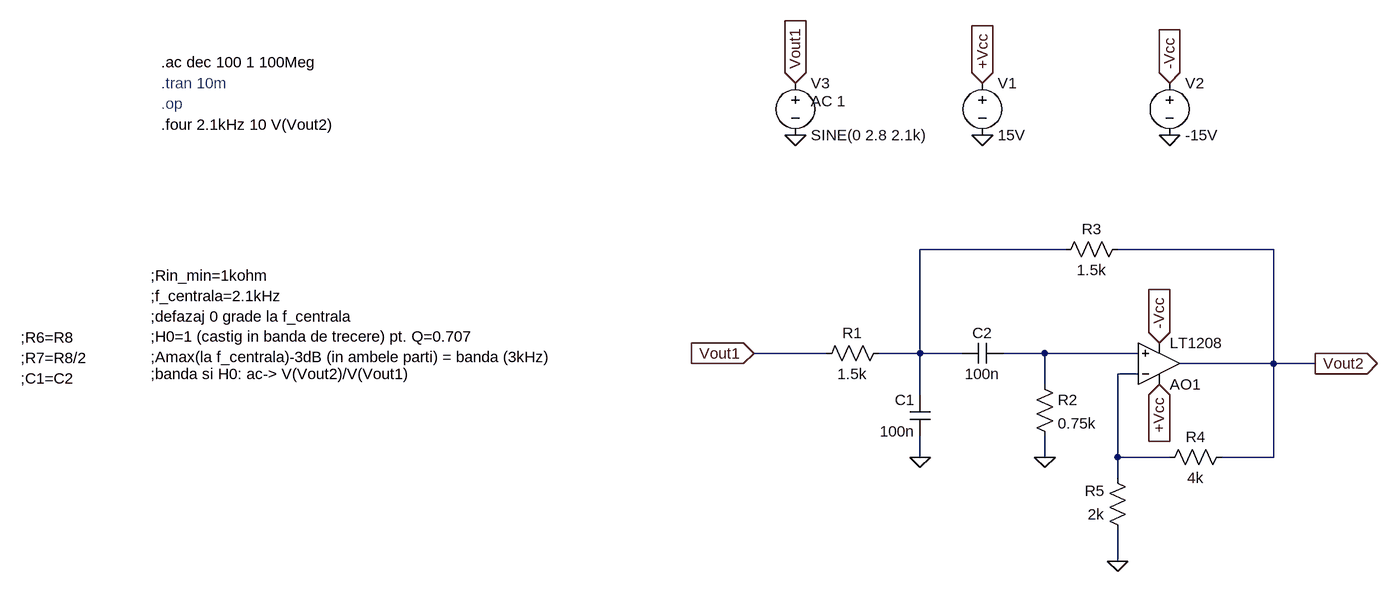
[diagram p0: schematic Filtru.asc]
Filtru.asc, the LTspice schematic file:
Version 4.1
SHEET 1 880 680
WIRE 336 -112 112 -112
WIRE 656 -112 416 -112
WIRE -32 48 -144 48
WIRE 112 48 112 -112
WIRE 112 48 48 48
WIRE 176 48 112 48
WIRE 304 48 240 48
WIRE 448 48 304 48
WIRE 656 64 656 -112
WIRE 656 64 512 64
WIRE 720 64 656 64
WIRE 448 80 416 80
WIRE 304 96 304 48
WIRE 112 112 112 48
WIRE 112 208 112 176
WIRE 304 208 304 176
WIRE 416 208 416 80
WIRE 496 208 416 208
WIRE 656 208 656 64
WIRE 656 208 576 208
WIRE 416 240 416 208
WIRE 416 368 416 320
FLAG -144 48 Vout1
IOPIN -144 48 In
FLAG 112 208 0
FLAG 304 208 0
FLAG 416 368 0
FLAG 720 64 Vout2
IOPIN 720 64 Out
FLAG 480 96 +Vcc
IOPIN 480 96 In
FLAG 480 32 -Vcc
IOPIN 480 32 In
FLAG 208 -368 +Vcc
IOPIN 208 -368 In
FLAG 496 -368 -Vcc
IOPIN 496 -368 In
FLAG 208 -288 0
FLAG 496 -288 0
FLAG -80 -368 Vout1
IOPIN -80 -368 In
FLAG -80 -288 0
SYMBOL res -48 64 R270
WINDOW 0 32 56 VTop 2
WINDOW 3 0 56 VBottom 2
SYMATTR InstName R1
SYMATTR Value 1.5k
SYMBOL cap 128 176 R180
WINDOW 0 24 56 Left 2
WINDOW 3 24 8 Left 2
SYMATTR InstName C1
SYMATTR Value 100n
SYMBOL cap 176 64 R270
WINDOW 0 32 32 VTop 2
WINDOW 3 0 32 VBottom 2
SYMATTR InstName C2
SYMATTR Value 100n
SYMBOL res 288 80 R0
SYMATTR InstName R2
SYMATTR Value 0.75k
SYMBOL OpAmps\\LT1208 480 128 M180
SYMATTR InstName AO1
SYMBOL res 320 -96 R270
WINDOW 0 32 56 VTop 2
WINDOW 3 0 56 VBottom 2
SYMATTR InstName R3
SYMATTR Value 1.5k
SYMBOL res 480 224 R270
WINDOW 0 32 56 VTop 2
WINDOW 3 0 56 VBottom 2
SYMATTR InstName R4
SYMATTR Value 4k
SYMBOL res 432 336 R180
WINDOW 0 36 76 Left 2
WINDOW 3 36 40 Left 2
SYMATTR InstName R5
SYMATTR Value 2k
SYMBOL voltage 208 -384 R0
WINDOW 123 24 44 Left 2
WINDOW 39 0 0 Left 0
SYMATTR InstName V1
SYMATTR Value 15V
SYMBOL voltage 496 -384 R0
SYMATTR InstName V2
SYMATTR Value -15V
SYMBOL voltage -80 -384 R0
WINDOW 123 24 44 Left 2
WINDOW 39 0 0 Left 0
SYMATTR Value2 AC 1
SYMATTR InstName V3
SYMATTR Value SINE(0 2.8 2.1k)
TEXT -1272 24 Left 2 !;R6=R8\n;R7=R8/2\n;C1=C2
TEXT -1072 -72 Left 2 !;Rin_min=1kohm
TEXT -1072 -40 Left 2 !;f_centrala=2.1kHz\n;defazaj 0 grade la f_centrala\n;H0=1 (castig in banda de trecere) pt. Q=0.707\n;Amax(la f_centrala)-3dB (in ambele parti) = banda (3kHz)
TEXT -1072 80 Left 2 !;banda si H0: ac-> V(Vout2)/V(Vout1)
TEXT -1056 -400 Left 2 !.ac dec 100 1 100Meg
TEXT -1056 -368 Left 2 ;.tran 10m
TEXT -1056 -336 Left 2 ;.op
TEXT -1056 -304 Left 2 !.four 2.1kHz 10 V(Vout2)

The netlist it stands for:
* Filtru.asc
R1 Vout1 N001 1.5k
C1 0 N001 100n
C2 N001 N002 100n
R2 N002 0 0.75k
X§AO1 N002 N003 +Vcc -Vcc Vout2 LT1208  ; pins In+ In- V+ V- OUT
R3 N001 Vout2 1.5k
R4 N003 Vout2 4k
R5 0 N003 2k
V1 +Vcc 0 15V
V2 -Vcc 0 -15V
V3 Vout1 0 SINE(0 2.8 2.1k) AC 1
;R6=R8
;R7=R8/2
;C1=C2
;Rin_min=1kohm
;f_centrala=2.1kHz
;defazaj 0 grade la f_centrala
;H0=1 (castig in banda de trecere) pt. Q=0.707
;Amax(la f_centrala)-3dB (in ambele parti) = banda (3kHz)
;banda si H0: ac-> V(Vout2)/V(Vout1)
.ac dec 100 1 100Meg
* .tran 10m
* .op
.four 2.1kHz 10 V(Vout2)
.backanno
.end